# Altium schematic sheet [04] - REVISION HISTORY.SchDoc
size Letter; CheckedBy: Pablo M.; DocumentNumber: 4; Revision: v1; SheetNumber: 4; SheetTotal: 5
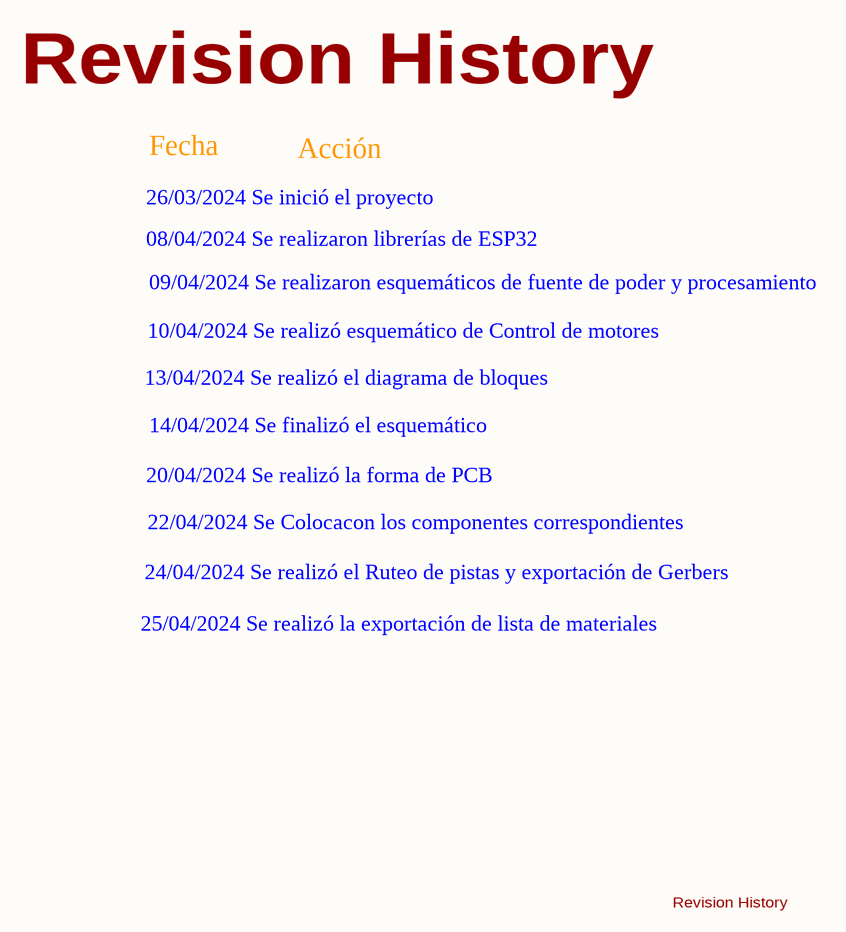
[diagram p0: [04] - REVISION HISTORY.SchDoc]

## Notes on the sheet
- Revision History
- 26/03/2024 Se inició el proyecto
- Fecha
- Acción
- 08/04/2024 Se realizaron librerías de ESP32
- 10/04/2024 Se realizó esquemático de Control de motores
- 09/04/2024 Se realizaron esquemáticos de fuente de poder y procesamiento
- 13/04/2024 Se realizó el diagrama de bloques
- 14/04/2024 Se finalizó el esquemático
- 20/04/2024 Se realizó la forma de PCB
- 22/04/2024 Se Colocacon los componentes correspondientes
- 24/04/2024 Se realizó el Ruteo de pistas y exportación de Gerbers
- 25/04/2024 Se realizó la exportación de lista de materiales
- Proyecto:
- Documento:
- Autor:
- Curso:
- Carnet:
- Fecha:
- Revisión:
- Tamaño:
- Carta
- Hoja:
- de